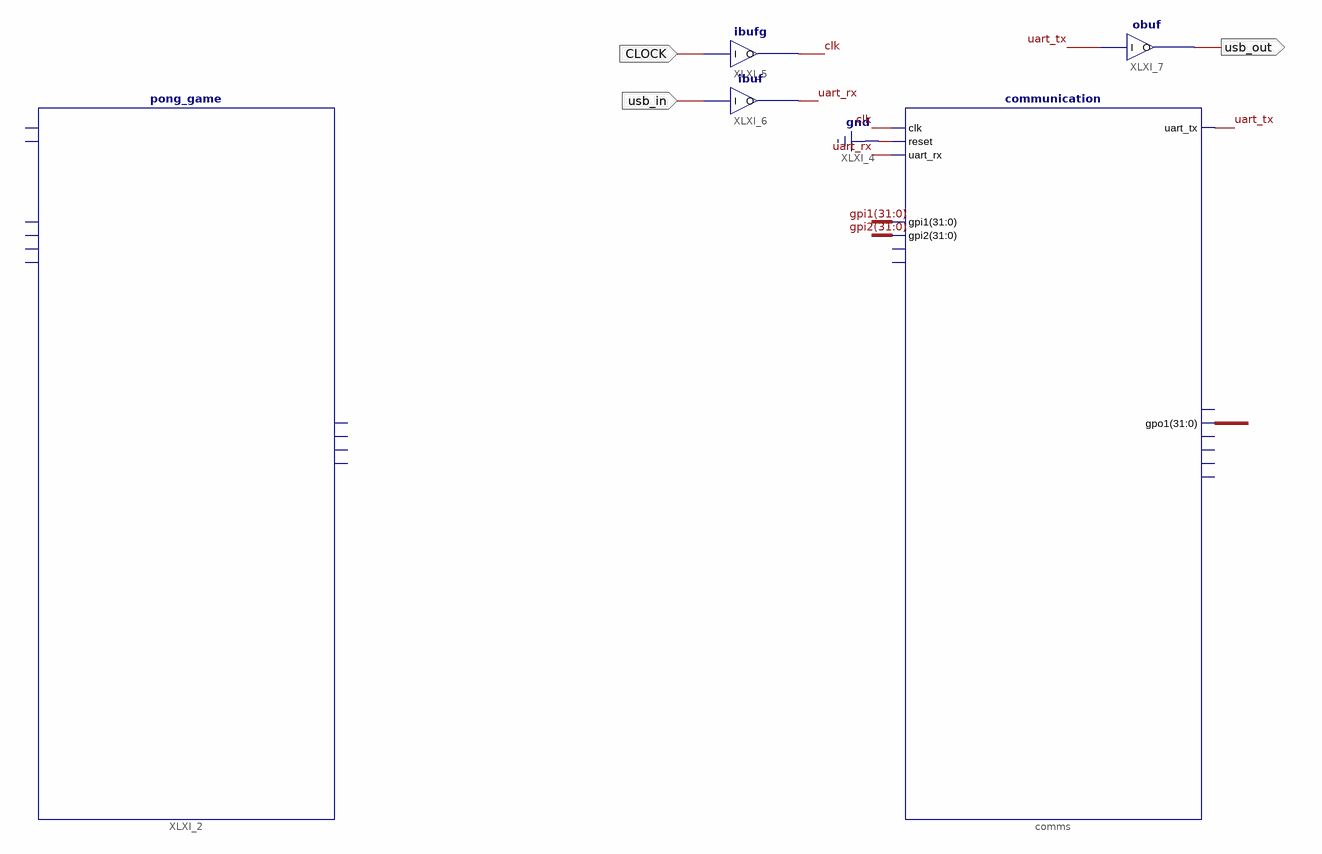
[diagram p0: schematic sheet 1]
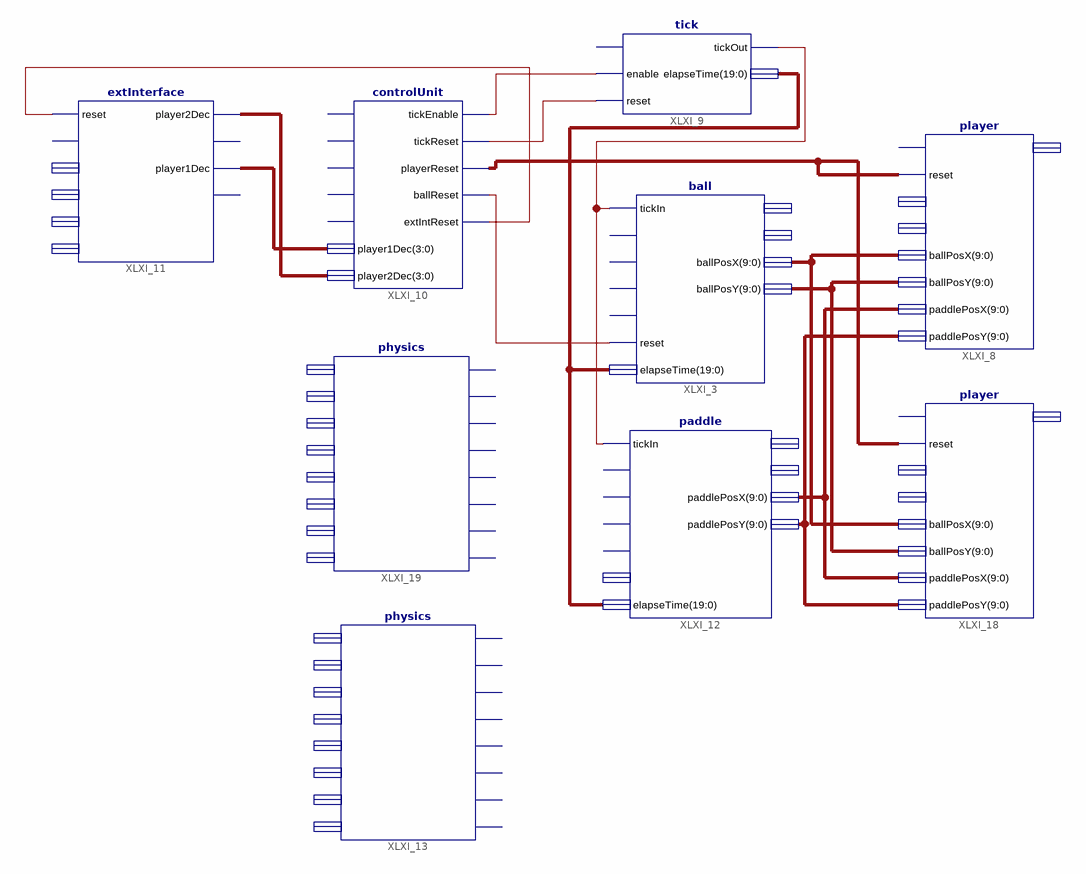
[diagram p1: schematic sheet 2]
// Xilinx ISE schematic pong.sch (artix7) as structural Verilog: 14 symbols, 3 ports
module pong (
  input  CLOCK,
  input  usb_in,
  output usb_out
);

  wire clk, uart_rx, uart_tx, XLXN_19, XLXN_20, XLXN_22, XLXN_23, XLXN_33;
  wire [3:0] XLXN_16, XLXN_17;
  wire [9:0] XLXN_39, XLXN_40, XLXN_51, XLXN_53;
  wire [19:0] XLXN_34;
  wire [31:0] gpi1, gpi2, gpo1;

  communication comms (
    .clk(clk), .reset(1'b0), .uart_tx(uart_tx), .uart_rx(uart_rx), .gpi1(gpi1), .gpi2(gpi2), .gpo1(gpo1));  // open: uart_interrupt, gpi3, gpi4, gpo2, gpo3, gpo4, intc_irq
  pong_game XLXI_2 ();  // open: clk, reset, gpi1, gpi2, gpi3, gpi4, gpo1, gpo2, gpo3, gpo4
  ibufg XLXI_5 (.I(CLOCK), .O(clk));
  ibuf XLXI_6 (.I(usb_in), .O(uart_rx));
  obuf XLXI_7 (.I(uart_tx), .O(usb_out));
  tick XLXI_9 (.enable(XLXN_22), .reset(XLXN_20), .tickOut(XLXN_33), .elapseTime(XLXN_34));  // open: clk
  controlUnit XLXI_10 (
    .player1Dec(XLXN_17), .player2Dec(XLXN_16), .tickEnable(XLXN_22), .tickReset(XLXN_20),
    .playerReset(XLXN_34), .ballReset(XLXN_19), .extIntReset(XLXN_23));  // open: scored, start, reset, win, clk
  extInterface XLXI_11 (
    .reset(XLXN_23), .player1Dec(XLXN_17), .player2Dec(XLXN_16));  // open: clk, p1decision, p2decision, extIn1, extIn2, extOut1, extOut2
  paddle XLXI_12 (
    .tickIn(XLXN_33), .elapseTime(XLXN_34), .paddlePosX(XLXN_51), .paddlePosY(XLXN_53));  // open: collTop, collBottom, collLeft, collRight, extIn, paddleWidth, paddleHeight
  physics XLXI_13 ();  // open: aTop, aBottom, aLeft, aRight, bTop, bBottom, bLeft, bRight, aCollTop, aCollBottom, aCollLeft, aCollRight, bCollTop, bCollBottom, bCollLeft, bCollRight
  ball XLXI_3 (
    .tickIn(XLXN_33), .reset(XLXN_19), .elapseTime(XLXN_34), .ballPosX(XLXN_39), .ballPosY(XLXN_40));  // open: collBottom, collLeft, collRight, ballWidth, ballHeight, collTop
  physics XLXI_19 ();  // open: aTop, aBottom, aLeft, aRight, bTop, bBottom, bLeft, bRight, aCollTop, aCollBottom, aCollLeft, aCollRight, bCollTop, bCollBottom, bCollLeft, bCollRight
  player XLXI_8 (
    .reset(XLXN_34), .ballPosX(XLXN_39), .ballPosY(XLXN_40), .paddlePosX(XLXN_51), .paddlePosY(XLXN_53));  // open: clk, ctrlSel, extIn, extOut
  player XLXI_18 (
    .reset(XLXN_34), .ballPosX(XLXN_39), .ballPosY(XLXN_40), .paddlePosX(XLXN_51), .paddlePosY(XLXN_53));  // open: clk, ctrlSel, extIn, extOut
endmodule
